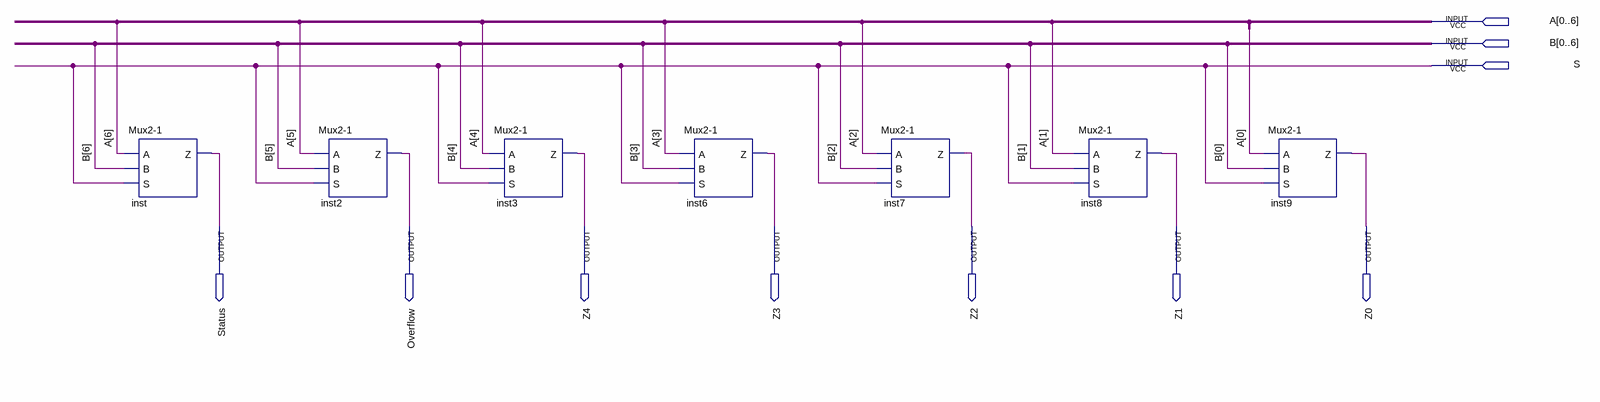
[diagram p0: schematic sheet]
// Quartus schematic mux-2-1_7bit.bdf as structural Verilog: 7 symbols, 10 pins
module \mux-2-1_7bit  (
  input  [0:6] A,
  input  [0:6] B,
  input  S,
  output Status,
  output Overflow,
  output Z4,
  output Z3,
  output Z2,
  output Z1,
  output Z0
);

  \Mux2-1  inst (.A(A[6]), .B(B[6]), .S(S), .Z(Status));
  \Mux2-1  inst2 (.A(A[5]), .B(B[5]), .S(S), .Z(Overflow));
  \Mux2-1  inst3 (.A(A[4]), .B(B[4]), .S(S), .Z(Z4));
  \Mux2-1  inst6 (.A(A[3]), .B(B[3]), .S(S), .Z(Z3));
  \Mux2-1  inst7 (.A(A[2]), .B(B[2]), .S(S), .Z(Z2));
  \Mux2-1  inst8 (.A(A[1]), .B(B[1]), .S(S), .Z(Z1));
  \Mux2-1  inst9 (.A(A[0]), .B(B[0]), .S(S), .Z(Z0));
endmodule
